# Altium project node_adapter.PrjPCB
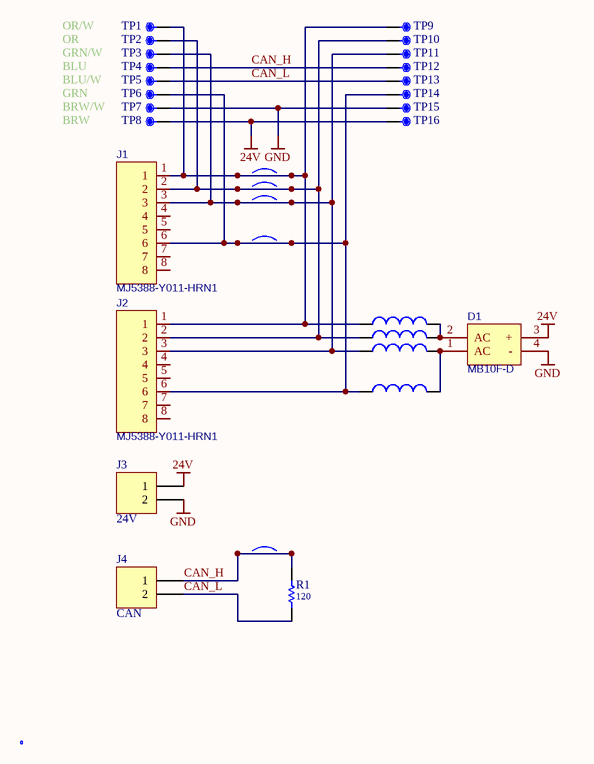
[diagram p0: schematic.SchDoc]
PRJ_ID: SH Node Adapter; PRJ_VER: v1.0.0
1 sheet, 32 parts. Net scope: global (net labels, ports and power ports of the same name join across sheets).
Board file: board.PcbDoc

## Sheet schematic.SchDoc
size A4; SheetNumber: 6; SheetTotal: 29

### Parts
D1  MB10F-D  [MINIDIP_4P-L4.7-W3.8-P2.50-LS7.0-BL]
J1  MJ5388-Y011-HRN1  [RJ45-TH_MJ5388-Y011-HRN1]
J2  MJ5388-Y011-HRN1  [RJ45-TH_MJ5388-Y011-HRN1]
J3  24V  [CONN_DG308-2.54-2P]
J4  CAN  [CONN_DG308-2.54-2P]
L1  BEAD  [L0603]  (value not drawn)
L2  BEAD  [L0603]  (value not drawn)
L3  BEAD  [L0603]  (value not drawn)
L4  BEAD  [L0603]  (value not drawn)
LOGO1  LOGO  [LOGO]  (value not drawn)  (no BOM)
R1  120  [R1206]
SB1  Circuit Breaker  [JMP0402_2]  (value not drawn)  (no BOM)
SB2  Circuit Breaker  [JMP0402_2]  (value not drawn)  (no BOM)
SB3  Circuit Breaker  [JMP0402_2]  (value not drawn)  (no BOM)
SB4  Circuit Breaker  [JMP0402_2]  (value not drawn)  (no BOM)
SB5  Circuit Breaker  [JMP0402_2]  (value not drawn)  (no BOM)
TP1  (no value)  [TP2030_SMD]  (no BOM)
TP2  (no value)  [TP2030_SMD]  (no BOM)
TP3  (no value)  [TP2030_SMD]  (no BOM)
TP4  (no value)  [TP2030_SMD]  (no BOM)
TP5  (no value)  [TP2030_SMD]  (no BOM)
TP6  (no value)  [TP2030_SMD]  (no BOM)
TP7  (no value)  [TP2030_SMD]  (no BOM)
TP8  (no value)  [TP2030_SMD]  (no BOM)
TP9  (no value)  [TP2030_SMD]  (no BOM)
TP10  (no value)  [TP2030_SMD]  (no BOM)
TP11  (no value)  [TP2030_SMD]  (no BOM)
TP12  (no value)  [TP2030_SMD]  (no BOM)
TP13  (no value)  [TP2030_SMD]  (no BOM)
TP14  (no value)  [TP2030_SMD]  (no BOM)
TP15  (no value)  [TP2030_SMD]  (no BOM)
TP16  (no value)  [TP2030_SMD]  (no BOM)

### Nets
24V: D1.3(+) J3.1 TP8.1 TP16.1
GND: D1.4(-) J3.2 TP7.1 TP15.1
CAN_H: J4.1 R1.1 SB5.1 SB5.2 TP4.1 TP12.1
CAN_L: J4.2 R1.2 TP5.1 TP13.1
NetD1_1: D1.1(AC) L3.1 L4.1
NetD1_2: D1.2(AC) L1.1 L2.1
NetJ1_1: J1.1 J2.1 L1.2 SB1.1 SB1.2 TP1.1 TP9.1
NetJ1_2: J1.2 J2.2 L2.2 SB2.1 SB2.2 TP2.1 TP10.1
NetJ1_3: J1.3 J2.3 L3.2 SB3.1 SB3.2 TP3.1 TP11.1
NetJ1_6: J1.6 J2.6 L4.2 SB4.1 SB4.2 TP6.1 TP14.1

Not connected (* = marked no-connect by the designer): J1 4 5 7 8; J2 4 5 7 8

### Notes on the sheet
- OR/W
- OR
- GRN/W
- GRN
- BLU
- BLU/W
- BRW/W
- BRW
- (in symbol RES) U

### Library data of the parts
J1 J2 = MJ88H-B011-HLRV1-1P_C2689153
J3 J4 = CONN MOLEX HDR-M 1x4: DG308-2.54-02P-14-00A(H); LCSC part number: C699496; P/N: DG308-2.54-02P-14-00A(H)
L1-L4 = BLM18AG601SN1D: 380mΩ ±25% 600Ω@100MHz 0603 Ferrite Beads; LCSC part number: C19330; P/N: BLM18AG601SN1D
R1 = RES: 120 1206
TP1-TP16 = TP_Dup1
D1 = MB10F-D: LCSC part number: C908753; P/N: MB10F-D